# Altium schematic sheet RX1.SchDoc
size A4
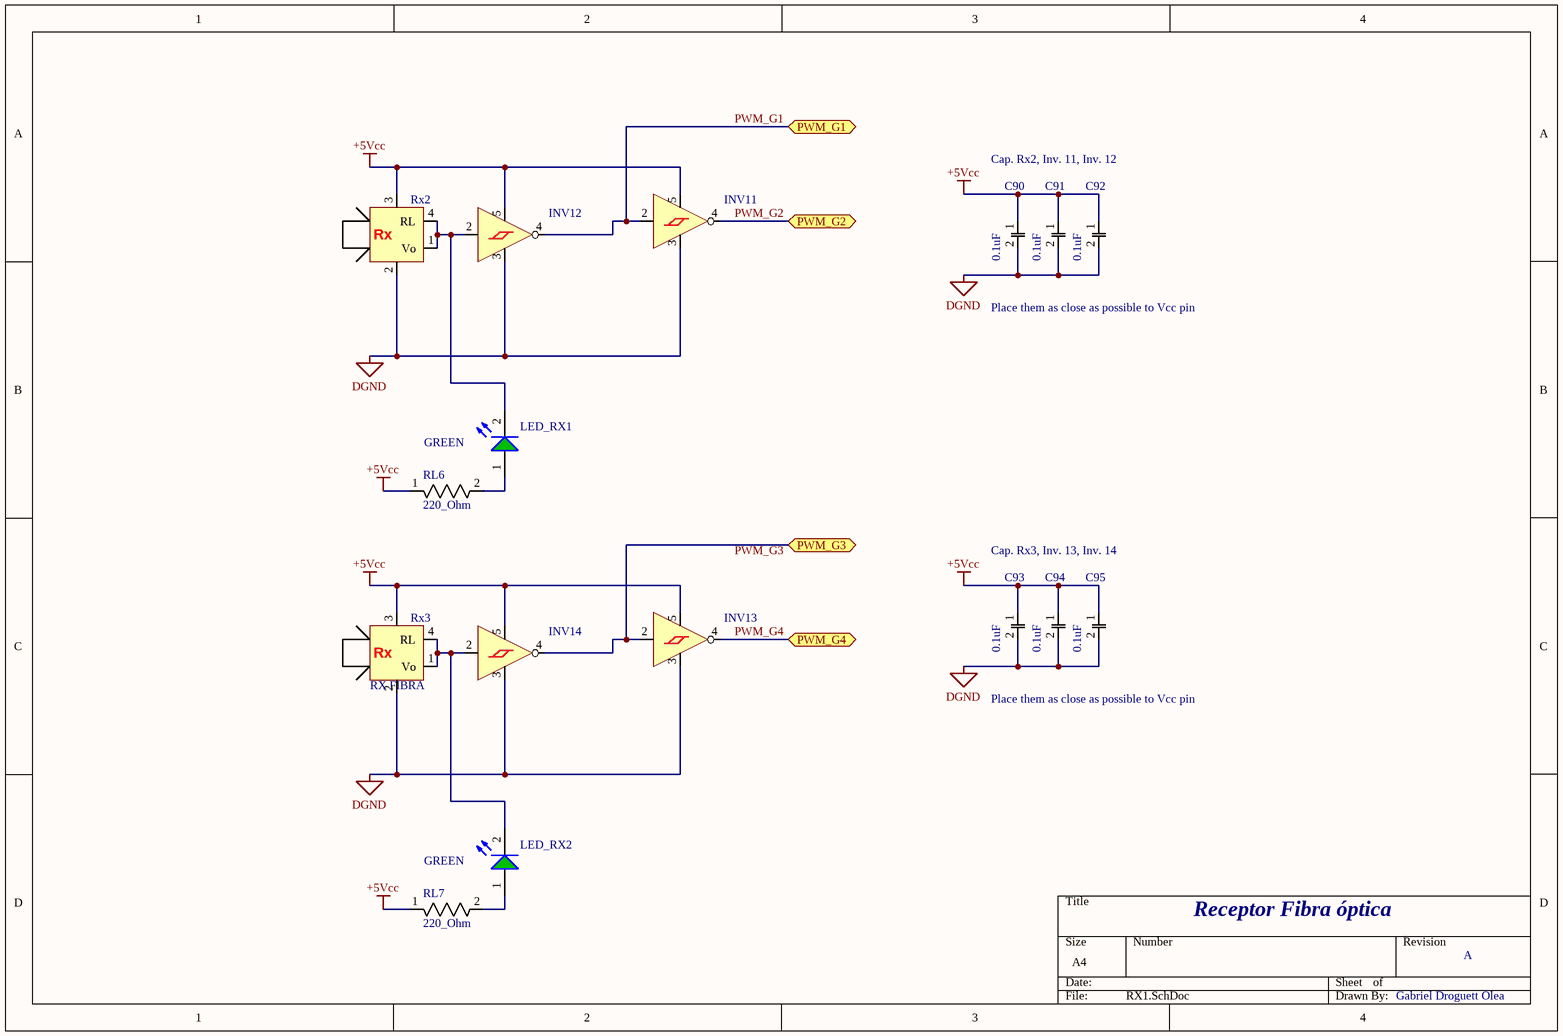
[diagram p0: RX1.SchDoc]

## Parts
C90  0.1uF  [CAP_0603]
C91  0.1uF  [CAP_0603]
C92  0.1uF  [CAP_0603]
C93  0.1uF  [CAP_0603]
C94  0.1uF  [CAP_0603]
C95  0.1uF  [CAP_0603]
INV11  NOT SCHMITT  [INV_SN74AHC1G14DBVR]  (value not drawn)
INV12  NOT SCHMITT  [INV_SN74AHC1G14DBVR]  (value not drawn)
INV13  NOT SCHMITT  [INV_SN74AHC1G14DBVR]  (value not drawn)
INV14  NOT SCHMITT  [INV_SN74AHC1G14DBVR]  (value not drawn)
LED_RX1  GREEN  [LED_0805]
LED_RX2  GREEN  [LED_0805]
RL6  220_Ohm  [res_0805]
RL7  220_Ohm  [res_0805]
Rx2  RX FIBRA  [Rx_HFBR-2521Z]  (value not drawn)
Rx3  RX FIBRA  [Rx_HFBR-2521Z]

## Ports
PWM_G1 (bidir), PWM_G2 (bidir), PWM_G3 (bidir), PWM_G4 (bidir)

## Nets
+5Vcc: C90.1 C91.1 C92.1 C93.1 C94.1 C95.1 INV11.5(Vcc) INV12.5(Vcc) INV13.5(Vcc) INV14.5(Vcc) RL6.1(C) RL7.1(C) Rx2.3(Vcc) Rx3.3(Vcc)
DGND: C90.2 C91.2 C92.2 C93.2 C94.2 C95.2 INV11.3(GND) INV12.3(GND) INV13.3(GND) INV14.3(GND) Rx2.2(GND) Rx3.2(GND)
PWM_G1: INV11.2(A) INV12.4(Vcc) ; port PWM_G1
PWM_G2: INV11.4(Vcc) ; port PWM_G2
PWM_G3: INV13.2(A) INV14.4(Vcc) ; port PWM_G3
PWM_G4: INV13.4(Vcc) ; port PWM_G4
NetINV12_2: INV12.2(A) LED_RX1.2(C) Rx2.1(Vo) Rx2.4(RL)
NetINV14_2: INV14.2(A) LED_RX2.2(C) Rx3.1(Vo) Rx3.4(RL)
NetLED_RX1_1: LED_RX1.1(A) RL6.2(A)
NetLED_RX2_1: LED_RX2.1(A) RL7.2(A)

Not connected (* = marked no-connect by the designer): INV11 1(NC); INV12 1(NC); INV13 1(NC); INV14 1(NC); Rx2 5(NC) 8(NC); Rx3 5(NC) 8(NC)

## Notes on the sheet
- Cap. Rx2, Inv. 11, Inv. 12
- Place them as close as possible to Vcc pin
- Cap. Rx3, Inv. 13, Inv. 14
- Receptor Fibra óptica
- A
- Gabriel Droguett Olea
- Labels drawn without touching a wire or pin: PWM_G3
- (in symbol Rx_HFBR-2521Z) Rx

## Library data of the parts
C90-C95 = CAP_0603YC104KAT2A: 0.1µF ±10% 16V Ceramic Capacitor X7R 0603 (1608 Metric); Digi-Key Part Number: 478-1239-1-ND; Manufacturer Part Number: 0603YC104KAT2A; RS Part Number: *
INV11-INV14 = INV_SN74AHC1G14DBVR: IC SCHMITT-TRG INV GATE SOT23-5; Digi-Key Part Number: 296-1092-1-ND; Manufacturer Part Number: SN74AHC1G14DBVR; RS Part Number: *
LED_RX1 LED_RX2 = WL-SMCW 0805  150080GS75000: LED GREEN DIFFUSED 0805 SMD; Manufacturer Part Number: LG R971-KN-1; Digi-Key Part Number: 475-1410-1-ND; RS Part Number: *
RL6 RL7 = RES_ERJ-3GEYJ471V: 1% 1/4W 0805; Manufacturer Part Number: RC0603FR-07220RL; Digi-Key Part Number: 311-220HRCT-ND; RS Part Number: *
Rx2 Rx3 = Rx_HFBR-2521Z: RECEIVER FIBER OPTIC 600NM 5MBD; Digi-Key Part Number: 516-2062-ND; Manufacturer Part Number: HFBR-2521Z; RS Part Number: 446-150